# Altium schematic sheet Rpi_power_supply.SchDoc
size A4; SheetNumber: 3; SheetTotal: 3
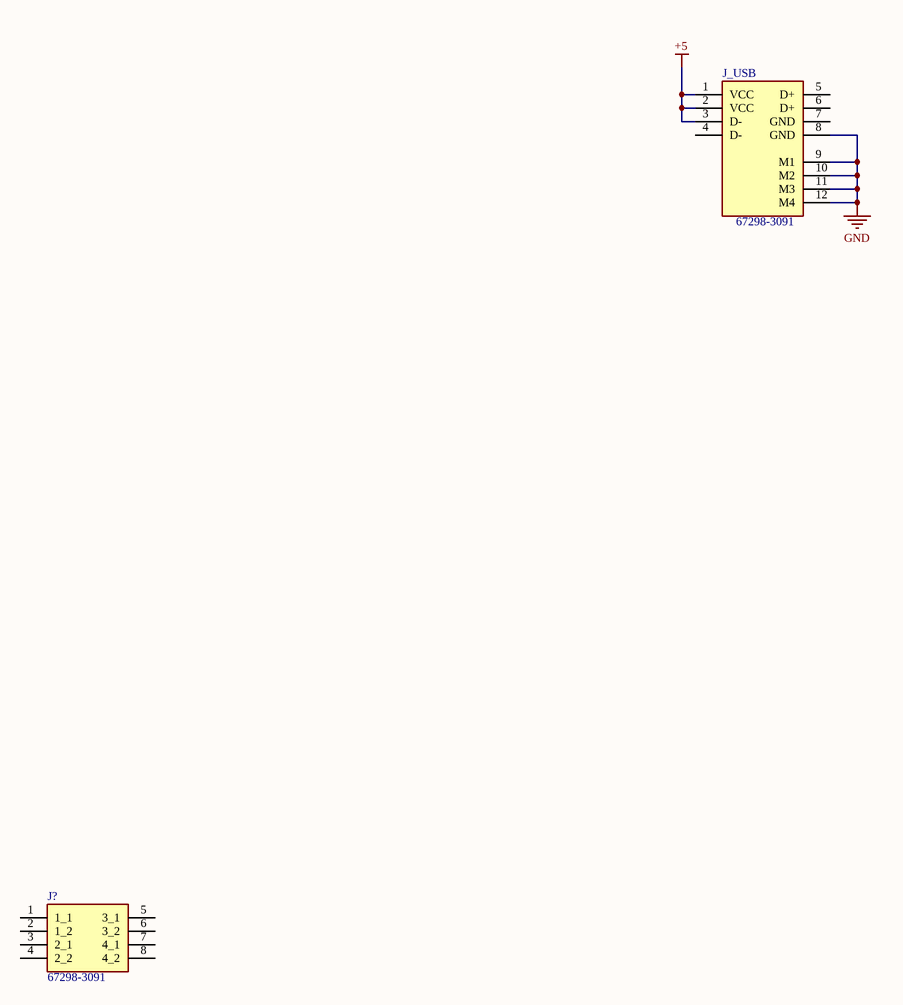
[diagram p0: Rpi_power_supply.SchDoc]

## Parts
J?  67298-3091  [67298-3091]
J_USB  67298-3091  [67298-3091]

## Nets
+5: J_USB.1(VCC) J_USB.2(VCC) J_USB.3(D-)
GND: J_USB.8(GND) J_USB.9(M1) J_USB.10(M2) J_USB.11(M3) J_USB.12(M4)

Not connected (* = marked no-connect by the designer): J? 1(1_1) 2(1_2) 3(2_1) 4(2_2) 5(3_1) 6(3_2) 7(4_1) 8(4_2); J_USB 4(D-) 5(D+) 6(D+) 7(GND)

## Library data of the parts
J? J_USB = 67298-3091: Connector; Manufacturer_Name: Molex; Datasheet Link: http://www.molex.com/webdocs/datasheets/pdf/en-us//0672983091_IO_CONNECTORS.pdf; Manufacturer_Part_Number: 67298-3091; Mouser Part Number: 538-67298-3091; Mouser Price/Stock: https://www.mouser.co.uk/ProductDetail/Molex/67298-3091?qs=naUSJSqnqcIXoje%2FIC6j2Q%3D%3D